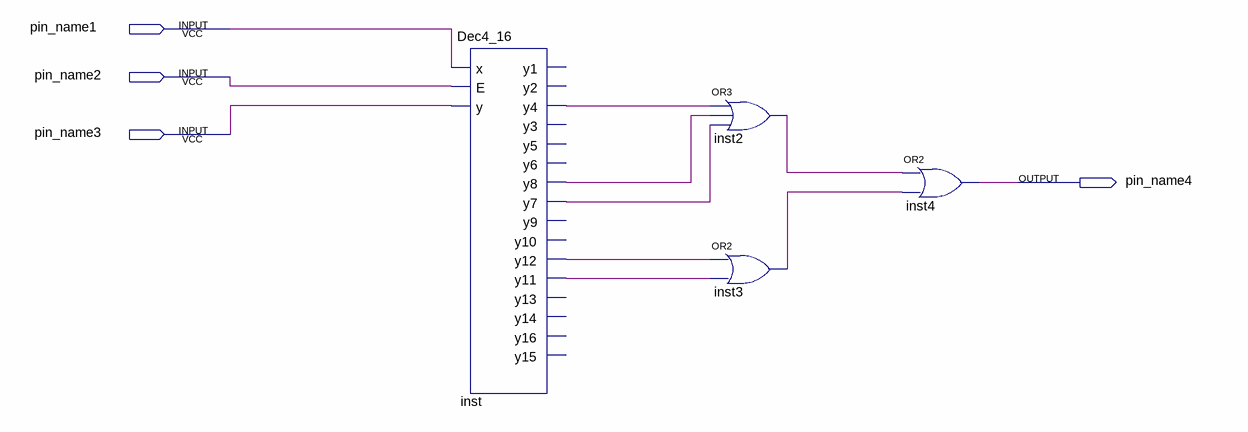
[diagram p0: schematic sheet]
// Quartus schematic DecoderDemo3.bdf as structural Verilog: 4 symbols, 4 pins
module DecoderDemo3 (
  input  pin_name1,
  input  pin_name2,
  input  pin_name3,
  output pin_name4
);

  wire inst2_out, inst3_out, inst_y4, inst_y7, inst_y8, inst_y11, inst_y12;

  Dec4_16 inst (
    .x(pin_name1), .E(pin_name2), .y(pin_name3), .y4(inst_y4), .y8(inst_y8), .y7(inst_y7), .y12(inst_y12),
    .y11(inst_y11));  // open: y1, y2, y3, y5, y6, y9, y10, y13, y14, y16, y15
  or inst2 (inst2_out, inst_y4, inst_y8, inst_y7);
  or inst3 (inst3_out, inst_y12, inst_y11);
  or inst4 (pin_name4, inst2_out, inst3_out);
endmodule
